# EAGLE design 8-Kanal-DIN-OUT_V1 (EAGLE 6.4)
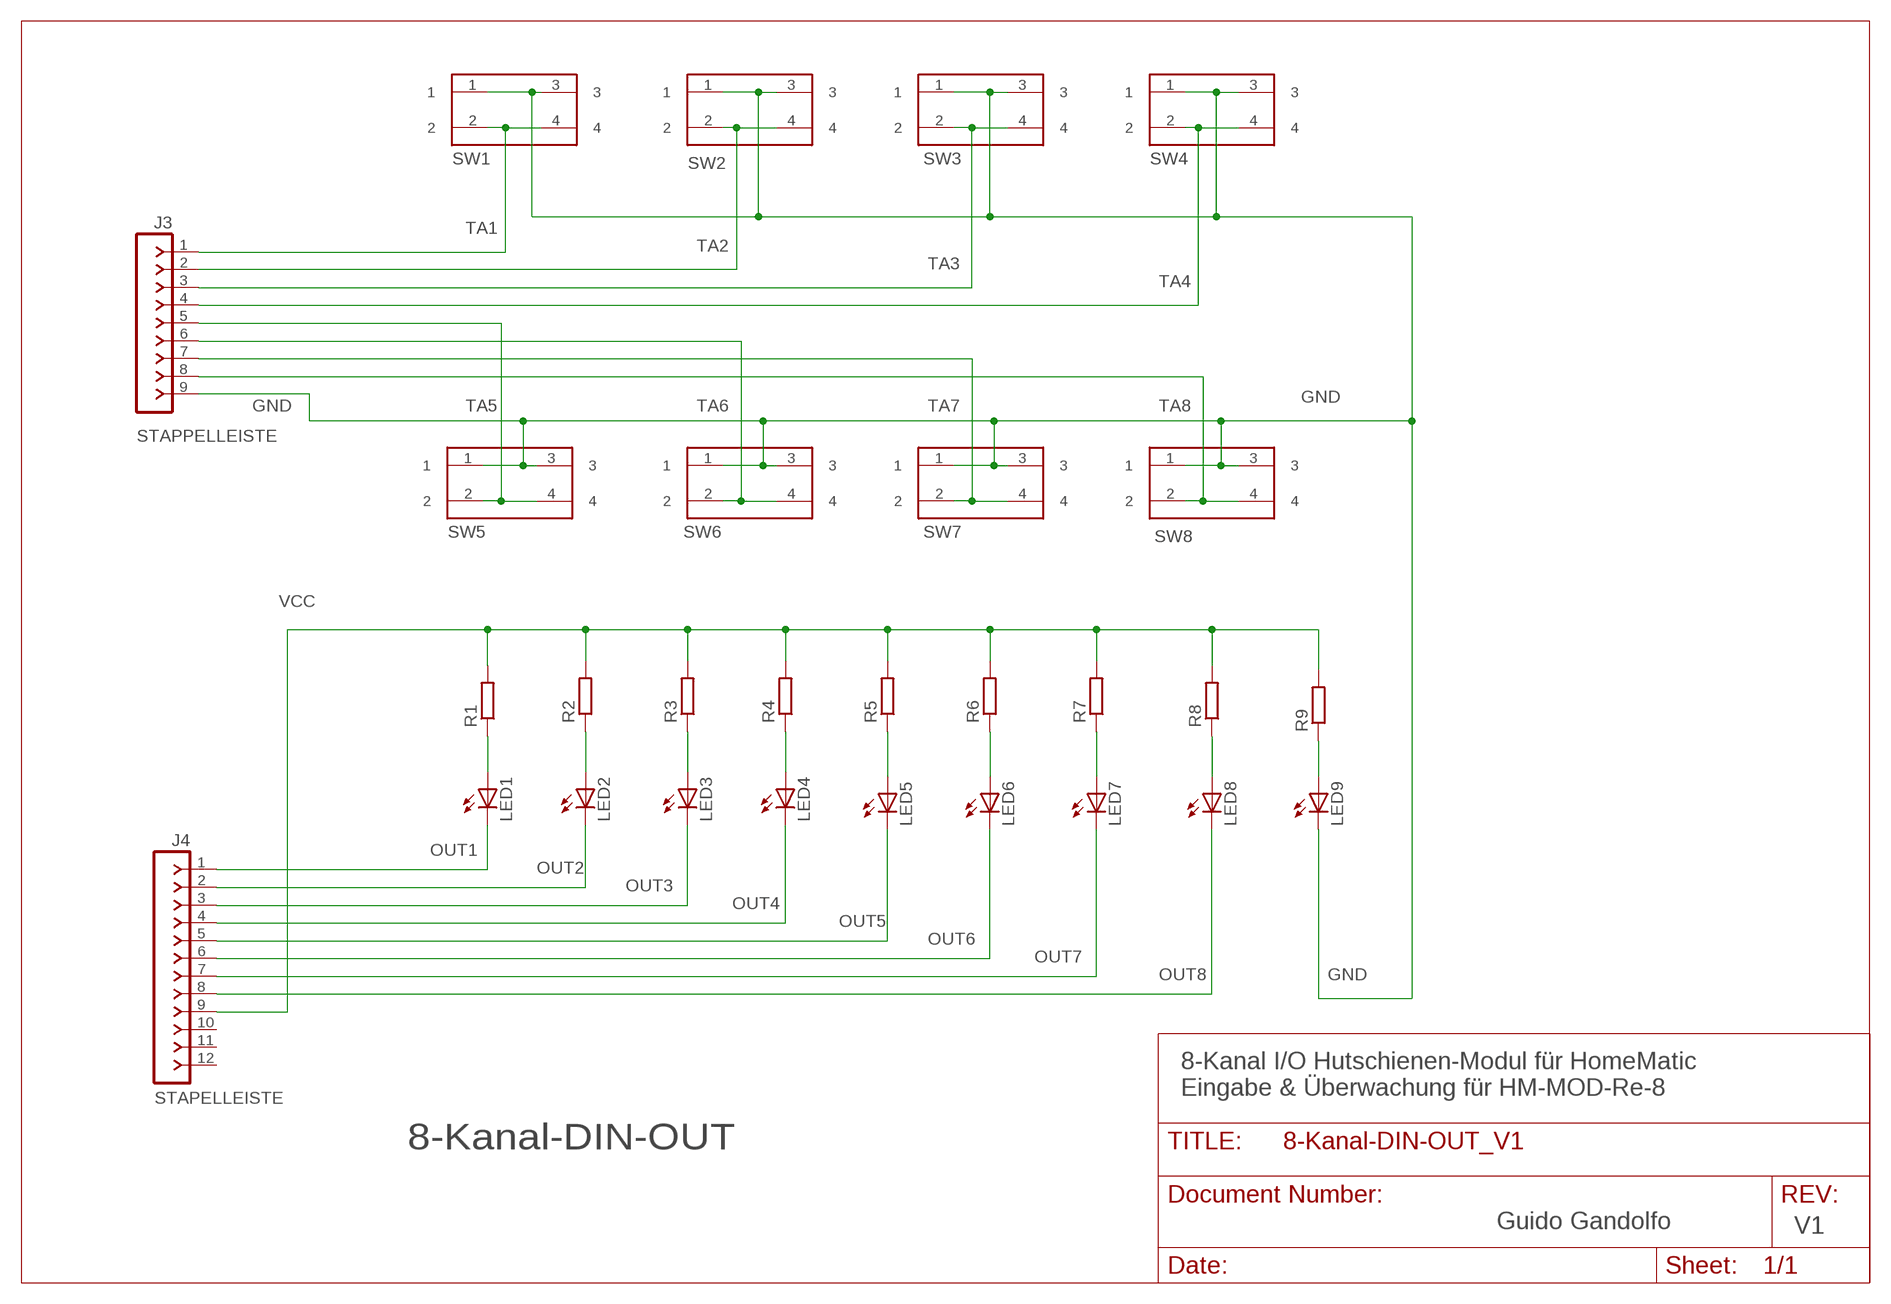
[diagram p0: schematic, sheet 1]

## Parts
J3  STAPPELLEISTE  F-1X09-SIP-100-40Y  [SIP-100-09-40Y]
J4  STAPELLEISTE  F-1X12-SIP-100-40Y  [SIP-100-12-40Y]
LED1  LED3MM  [LED3MM]
LED2  LED3MM  [LED3MM]
LED3  LED3MM  [LED3MM]
LED4  LED3MM  [LED3MM]
LED5  LED3MM  [LED3MM]
LED6  LED3MM  [LED3MM]
LED7  LED3MM  [LED3MM]
LED8  LED3MM  [LED3MM]
LED9  LED3MM  [LED3MM]
R1  R-EU_0207/2V  [0207/2V]
R2  R-EU_0207/2V  [0207/2V]
R3  R-EU_0207/2V  [0207/2V]
R4  R-EU_0207/2V  [0207/2V]
R5  R-EU_0207/2V  [0207/2V]
R6  R-EU_0207/2V  [0207/2V]
R7  R-EU_0207/2V  [0207/2V]
R8  R-EU_0207/2V  [0207/2V]
R9  R-EU_0207/2V  [0207/2V]
SW1  TASTER 9305  430156130936  [430156130936]
SW2  TASTER 9305  430156130936  [430156130936]
SW3  TASTER 9305  430156130936  [430156130936]
SW4  TASTER 9305  430156130936  [430156130936]
SW5  TASTER 9305  430156130936  [430156130936]
SW6  TASTER 9305  430156130936  [430156130936]
SW7  TASTER 9305  430156130936  [430156130936]
SW8  TASTER 9305  430156130936  [430156130936]

## Nets
GND: J3.9 LED9.K(C) SW1.1 SW1.3 SW2.1 SW2.3 SW3.1 SW3.3 SW4.1 SW4.3 SW5.1 SW5.3 SW6.1 SW6.3 SW7.1 SW7.3 SW8.1 SW8.3
N$3: LED1.A R1.1
N$11: LED2.A R2.1
N$13: LED3.A R3.1
N$14: LED4.A R4.1
N$15: LED5.A R5.1
N$16: LED6.A R6.1
N$17: LED7.A R7.1
N$18: LED8.A R8.1
N$19: LED9.A R9.1
OUT1: J4.1 LED1.K(C)
OUT2: J4.2 LED2.K(C)
OUT3: J4.3 LED3.K(C)
OUT4: J4.4 LED4.K(C)
OUT5: J4.5 LED5.K(C)
OUT6: J4.6 LED6.K(C)
OUT7: J4.7 LED7.K(C)
OUT8: J4.8 LED8.K(C)
TA1: J3.1 SW1.2 SW1.4
TA2: J3.2 SW2.2 SW2.4
TA3: J3.3 SW3.2 SW3.4
TA4: J3.4 SW4.2 SW4.4
TA5: J3.5 SW5.2 SW5.4
TA6: J3.6 SW6.2 SW6.4
TA7: J3.7 SW7.2 SW7.4
TA8: J3.8 SW8.2 SW8.4
VCC: J4.9 R1.2 R2.2 R3.2 R4.2 R5.2 R6.2 R7.2 R8.2 R9.2
Unconnected: J4.10 J4.11 J4.12

## Notes on the sheet
- 8-Kanal I/O Hutschienen-Modul für HomeMatic 
  Eingabe & Überwachung für HM-MOD-Re-8
- 8-Kanal-DIN-OUT
- Guido Gandolfo | V1

## Library data of the parts
J3 = con-headers-jp:F-1X09-: FEMALE HEADER
J4 = con-headers-jp:F-1X12-: FEMALE HEADER
LED1-LED9 = led:LED: LED OSRAM: - CHIPLED LG R971, LG N971, LY N971, LG Q971, LY Q971, LO R971, LY R971 LH N974, LH R974 LS Q976, LO Q976, LY Q976 LO Q996 - Hyper CHIPLED LW Q18S LB Q993, LB Q99A, LB R99A - SideLED LS A670, LO A670, LY A670, LG A670, LP A670 LB A673, LV A673, LT A673, LW A673 LH A674 LY A675 LS A676, LA A676, LO A676, LY A676, LW A676 LS A679, LY A679, LG A679 - Hyper Micro SIDELED® LS Y876, LA Y876, LO Y876, LY Y876 LT Y87S - SmartLED LW L88C, LW L88S LB L89C, LB L89S, LG L890 LS L89K, LO L89K, LY L89K LS L896, LA L896, LO L896, LY L896 - TOPLED LS T670, LO T670, LY T670, LG T670, LP T670 LSG T670, LSP T670, LSY T670, LOP T670, LYG T670 LG T671, LOG T671, LSG T671 LB T673, LV T673, LT T673, LW T673 LH T674 LS T676, LA T676, LO T676, LY T676, LB T676, LH T676, LSB T676, LW T676 LB T67C, LV T67C, LT T67C, LS T67K, LO T67K, LY T67K, LW E67C LS E67B, LA E67B, LO E67B, LY E67B, LB E67C, LV E67C, LT E67C LW T67C LS T679, LY T679, LG T679 LS T770, LO T770, LY T770, LG T770, LP T770 LB T773, LV T773, LT T773, LW T773 LH T774 LS E675, LA E675, LY E675, LS T675 LS T776, LA T776, LO T776, LY T776, LB T776 LHGB T686 LT T68C, LB T68C - Hyper Mini TOPLED® LB M676 - Mini TOPLED Santana® LG M470 LS M47K, LO M47K, LY M47K Source: http://www.osram.convergy.de LUXEON: - LUMILED® LXK2-PW12-R00, LXK2-PW12-S00, LXK2-PW14-U00, LXK2-PW14-V00 LXK2-PM12-R00, LXK2-PM12-S00, LXK2-PM14-U00 LXK2-PE12-Q00, LXK2-PE12-R00, LXK2-PE12-S00, LXK2-PE14-T00, LXK2-PE14-U00 LXK2-PB12-K00, LXK2-PB12-L00, LXK2-PB12-M00, LXK2-PB14-N00, LXK2-PB14-P00, LXK2-PB14-Q00 LXK2-PR12-L00, LXK2-PR12-M00, LXK2-PR14-Q00, LXK2-PR14-R00 LXK2-PD12-Q00, LXK2-PD12-R00, LXK2-PD12-S00 LXK2-PH12-R00, LXK2-PH12-S00 LXK2-PL12-P00, LXK2-PL12-Q00, LXK2-PL12-R00 Source: www.luxeon.com KINGBRIGHT: KA-3528ASYC Source: www.kingbright.com
R1-R9 = resistor:R-EU_: RESISTOR, European symbol
SW1-SW8 = Switch_rev16b_wurth:430156130936: WS-TST-6x6 mm THT Tact Switch,4 pins

## Board
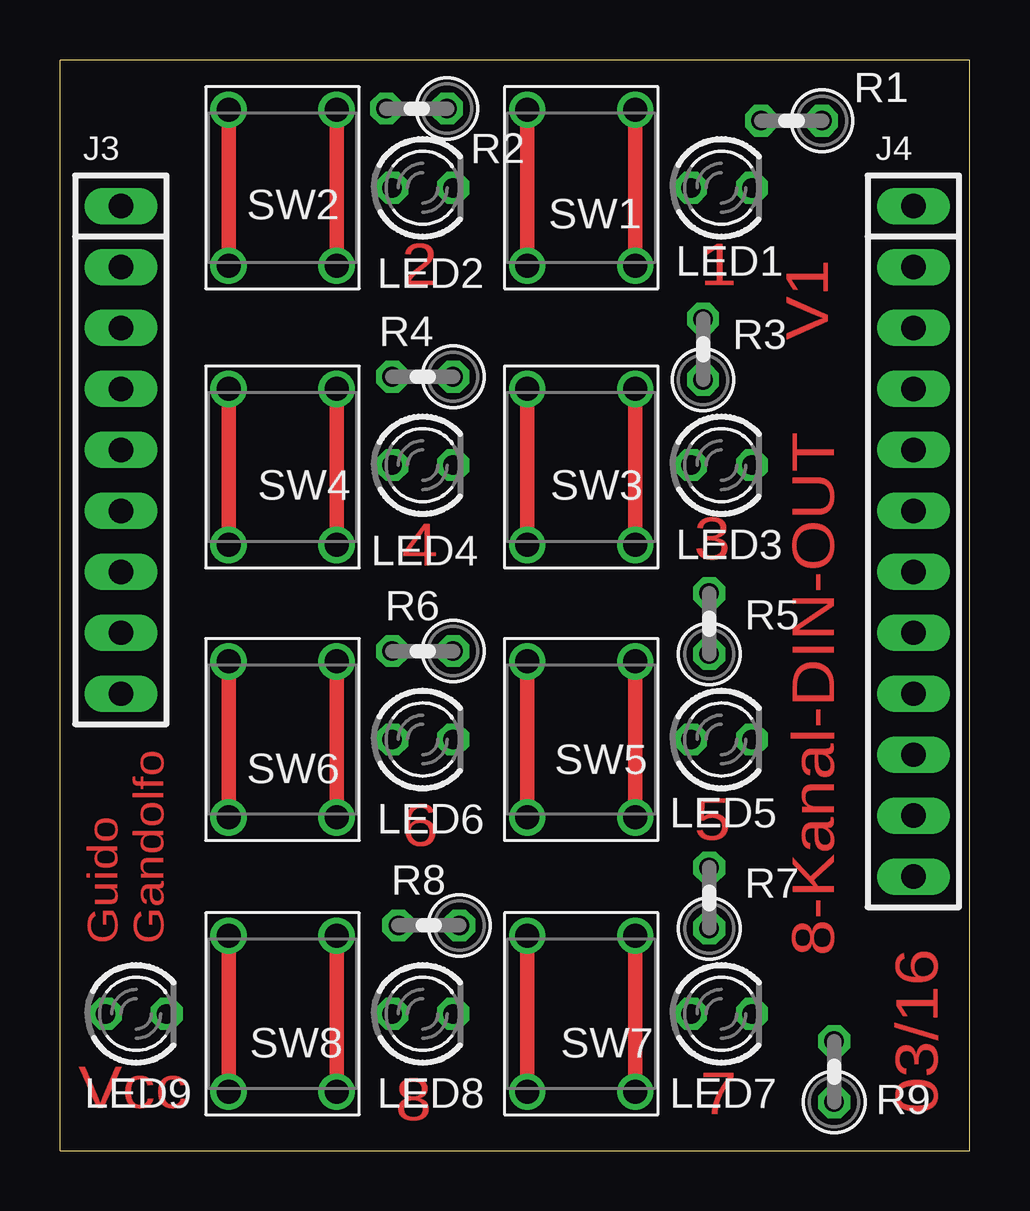
[diagram p1: board, top side]
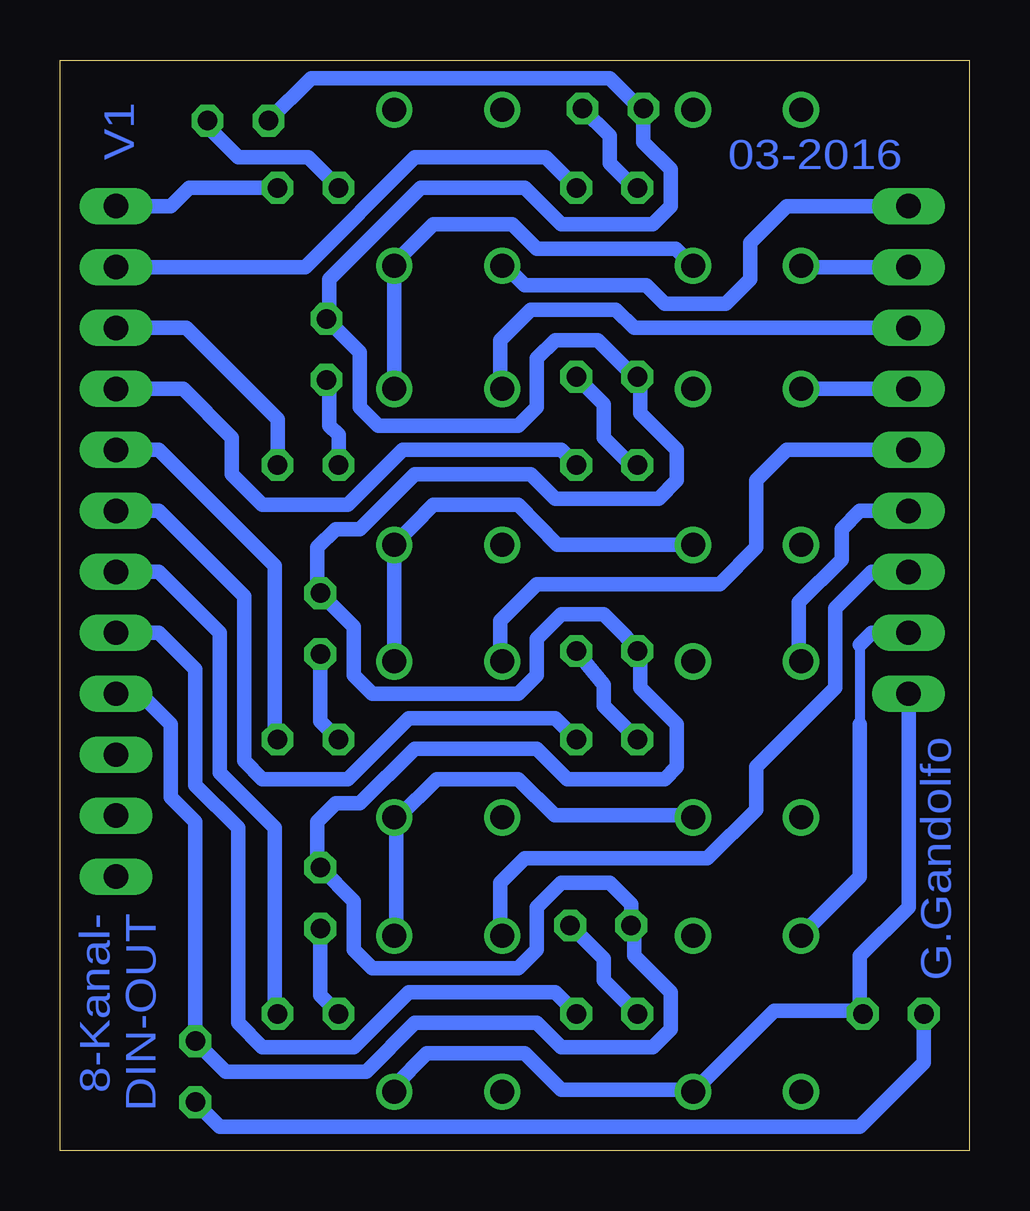
[diagram p2: board, bottom side, seen from below]

Size 37.9 x 45.46 mm. Coordinates in mm from the lower left corner, seen from the top.
Outline: 0,0 0,0
Outline: 0,0 37.9,0 37.9,45.46 0,45.46
Outline: 0,45.46 0,45.46
Outline: 0,0 0,45.46
Copper layers (1*16): Top 0.035mm / dielectric 1.5mm / Bottom 0.035mm
Design rules "default": minimum track width 10mil, minimum drill 24mil, track to track 8mil, track to pad 8mil, pad to pad 8mil, via to via 8mil, smd to smd 8mil, copper to edge 40mil, drill to drill 8mil, minimum pad ring 10mil, minimum via ring 8mil, stop-mask expansion 4mil, vias tented up to drill 0mil, thermal gap 10mil

### Footprints (pad centres in the part's own frame; a part is rotated, then mirrored left to right if it is on the bottom)
SIP-100-09-40Y = drill 1.016 long: 1 -10.16,0; 2 -7.62,0; 3 -5.08,0; 4 -2.54,0; 5 0,0; 6 2.54,0; 7 5.08,0; 8 7.62,0; 9 10.16,0
SIP-100-12-40Y = drill 1.016 long: 1 -13.97,0; 2 -11.43,0; 3 -8.89,0; 4 -6.35,0; 5 -3.81,0; 6 -1.27,0; 7 1.27,0; 8 3.81,0; 9 6.35,0; 10 8.89,0; 11 11.43,0; 12 13.97,0
LED3MM = drill 0.813 octagon: A -1.27,0; K 1.27,0
0207/2V = drill 0.813 octagon: 1 -1.27,0; 2 1.27,0
430156130936 = drill 1: 1 -3.25,2.25; 2 -3.25,-2.25; 3 3.25,2.25; 4 3.25,-2.25

### Placement (x,y rotation side)
J3  2.54,29.21 270 top
J4  35.56,25.4 270 top
LED1  27.56,40.13 0 top
LED2  15.11,40.13 0 top
LED3  27.56,28.57 0 top
LED4  15.11,28.57 0 top
LED5  27.56,17.14 0 top
LED6  15.11,17.14 0 top
LED7  27.56,5.71 0 top
LED8  15.11,5.71 0 top
LED9  3.17,5.71 0 top
R1  30.48,42.93 180 top
R2  14.86,43.43 180 top
R3  26.8,33.4 90 top
R4  15.11,32.26 180 top
R5  27.05,21.97 90 top
R6  15.11,20.83 180 top
R7  27.05,10.54 90 top
R8  15.37,9.4 180 top
R9  32.26,3.3 90 top
SW1  21.72,40.13 270 top
SW2  9.27,40.13 270 top
SW3  21.72,28.5 270 top
SW4  9.27,28.5 270 top
SW5  21.72,17.14 270 top
SW6  9.27,17.14 270 top
SW7  21.72,5.71 270 top
SW8  9.27,5.71 270 top

### Tracks (layer width: path | path; a pad name or v marks a point on that pad's centre or on a via)
GND
  Top 0.61: SW5.3 SW5.1 | SW8.1 SW8.3 | SW7.3 SW7.1 | SW3.3 SW3.1 | SW1.3 SW1.1 | SW2.3 SW2.1 | SW4.1 SW4.3 | SW6.1 SW6.3
  Bottom 0.61: J3.9 2.54,10.16 4.57,8.13 4.57,5.84 | 4.57,5.84 LED9.K | 4.57,5.84 8.14,5.84 SW8.3 11.6,2.54 17.02,2.54 18.54,4.06 22.61,4.06 23.97,2.7 SW7.3 | SW6.3 11.43,13.99 17.29,13.99 18.8,15.49 22.2,15.49 23.8,13.89 SW5.3 23.89,13.82 23.89,8.89 SW7.1 | SW5.1 SW3.3 22.35,26.92 18.8,26.92 17.17,25.25 SW4.3 | SW3.1 SW1.3 23.82,37.14 22.35,38.61 19.05,38.61 18.03,37.59 12.23,37.59 SW2.3
N$3
  Bottom 0.61: LED1.A 27.56,41.4 30.48,41.4 31.75,42.67 R1.1
N$11
  Bottom 0.61: LED2.A 13.97,40.13 14.99,41.15 14.99,42.29 R2.1
N$13
  Bottom 0.61: LED3.A 26.29,29.84 26.67,30.23 26.67,32 R3.1
N$14
  Bottom 0.61: LED4.A 14.1,28.57 15.24,29.72 15.24,31.11 R4.1
N$15
  Bottom 0.61: LED5.A 27.05,17.91 R5.1
N$16
  Bottom 0.61: LED6.A 15.24,18.54 15.24,19.43 R6.1
N$17
  Bottom 0.61: LED7.A 27.05,6.48 R7.1
N$18
  Bottom 0.61: LED8.A 15.24,7.11 15.24,8 R8.1
N$19
  Bottom 0.61: LED9.A 1.91,3.68 4.57,1.02 31.24,1.02 R9.1
OUT1
  Bottom 0.61: LED1.K 32.51,40.13 33.27,39.37 J4.1
OUT2
  Bottom 0.61: J4.2 27.69,36.83 23.11,41.4 17.65,41.4 LED2.K
OUT3
  Bottom 0.61: J4.3 32.64,34.29 28.83,30.48 LED3.K
OUT4
  Bottom 0.61: J4.4 32.77,31.75 30.73,29.72 30.73,28.19 29.46,26.92 25.91,26.92 23.62,29.21 17.02,29.21 LED4.K
OUT5
  Bottom 0.61: J4.5 33.78,29.21 28.96,24.38 28.96,17.27 LED5.K
OUT6
  Bottom 0.61: J4.6 33.78,26.67 30.23,23.11 30.23,16.26 29.46,15.49 25.91,15.49 23.37,18.03 17.27,18.03 LED6.K
OUT7
  Bottom 0.61: J4.7 33.78,24.13 31.24,21.59 31.24,15.75 28.96,13.46 28.96,5.84 LED7.K
OUT8
  Bottom 0.61: J4.8 33.78,21.59 32.26,20.07 32.26,15.24 30.48,13.46 30.48,5.33 29.46,4.32 25.65,4.32 23.37,6.6 17.27,6.6 LED8.K
TA1
  Top 0.61: SW1.2 SW1.4
  Bottom 0.61: J3.1 7.62,39.37 9.14,37.85 9.14,36.32 10.16,35.31 12.7,35.31 13.46,36.07 18.54,36.07 19.36,36.88 SW1.4 19.41,36.83
TA2
  Top 0.61: SW2.4 SW2.2
  Bottom 0.61: J3.2 6.97,36.83 arc90 SW2.4
TA3
  Top 0.61: SW3.2 SW3.4
  Bottom 0.61: J3.3 13.97,34.29 14.73,35.05 18.29,35.05 19.56,33.78 19.56,31.84 SW3.2
TA4
  Top 0.61: SW4.2 SW4.4
  Bottom 0.61: J3.4 7.2,31.75 SW4.2
TA5
  Top 0.61: SW5.2 SW5.4
  Bottom 0.61: J3.5 7.62,29.21 8.89,27.94 8.89,25.15 10.41,23.62 18.03,23.62 19.56,22.1 19.56,20.49 SW5.2
TA6
  Top 0.61: SW6.2 SW6.4
  Bottom 0.61: J3.6 4.57,26.67 5.33,25.91 5.33,24.64 7.11,22.86 7.11,20.49 SW6.2
TA7
  Top 0.61: SW7.2 SW7.4
  Bottom 0.61: J3.7 4.06,24.13 5.59,22.61 5.59,19.3 8.89,16 8.89,14.22 10.92,12.19 18.54,12.19 19.56,11.18 19.56,9.06 SW7.2
TA8
  Top 0.61: SW8.2 SW8.4
  Bottom 0.406: 4.57,21.08 4.57,17.78
  Bottom 0.61: J3.8 4.06,21.59 4.57,21.08 | SW8.2 7.02,8.98 4.57,11.43 4.57,17.78
VCC
  Bottom 0.61: R8.2 14.1,10.29 14.99,11.18 17.02,11.18 18.03,10.16 18.03,8.38 18.8,7.62 24.89,7.62 25.65,8.38 25.65,10.41 R7.2 27.18,11.94 27.18,13.72 26.42,14.48 25.4,14.48 23.11,16.76 18.03,16.76 16.76,15.49 12.7,15.49 12.19,16 12.19,17.78 13.72,19.3 13.72,20.7 R6.2 14.35,21.46 15.24,22.35 17.02,22.35 18.03,21.34 18.03,19.81 18.8,19.05 24.89,19.05 25.65,19.81 25.65,21.84 R5.2 27.18,23.37 27.18,25.15 26.42,25.91 25.4,25.91 23.11,28.19 18.29,28.19 17.27,27.18 12.95,27.18 12.19,27.94 12.19,29.21 13.72,30.73 13.72,32.13 R4.2 13.97,32.26 15.49,33.78 17.27,33.78 18.03,33.02 18.03,30.99 18.8,30.23 24.64,30.23 25.4,30.99 25.4,33.27 26.67,34.54 | 26.67,34.54 26.67,36.32 22.86,40.13 18.54,40.13 17.02,38.61 13.21,38.61 12.45,39.37 12.45,40.89 13.59,42.04 R2.2 13.72,43.43 14.99,44.7 27.43,44.7 R1.2 | J4.9 34.54,19.05 33.27,17.78 33.27,14.73 32.26,13.72 R9.2 30.99,3.3 25.15,3.3 23.11,5.33 18.03,5.33 17.02,4.32 13.21,4.32 12.45,5.08 12.45,6.6 13.97,8.13 13.97,9.27 R8.2 | R8.2 14.1,9.27 | 26.67,34.54 R3.2

### Text on the board
Top: 2 | 1 | V1 | 3 | 4 | 6 | 5 | Guido / Gandolfo | 8-Kanal-DIN-OUT | Vcc | 7 | 03/16 | 8
Bottom: V1 | 03-2016 | 8-Kanal- / DIN-OUT | G.Gandolfo